# EAGLE design SafetySwitchBoard (EAGLE 9.5.2)
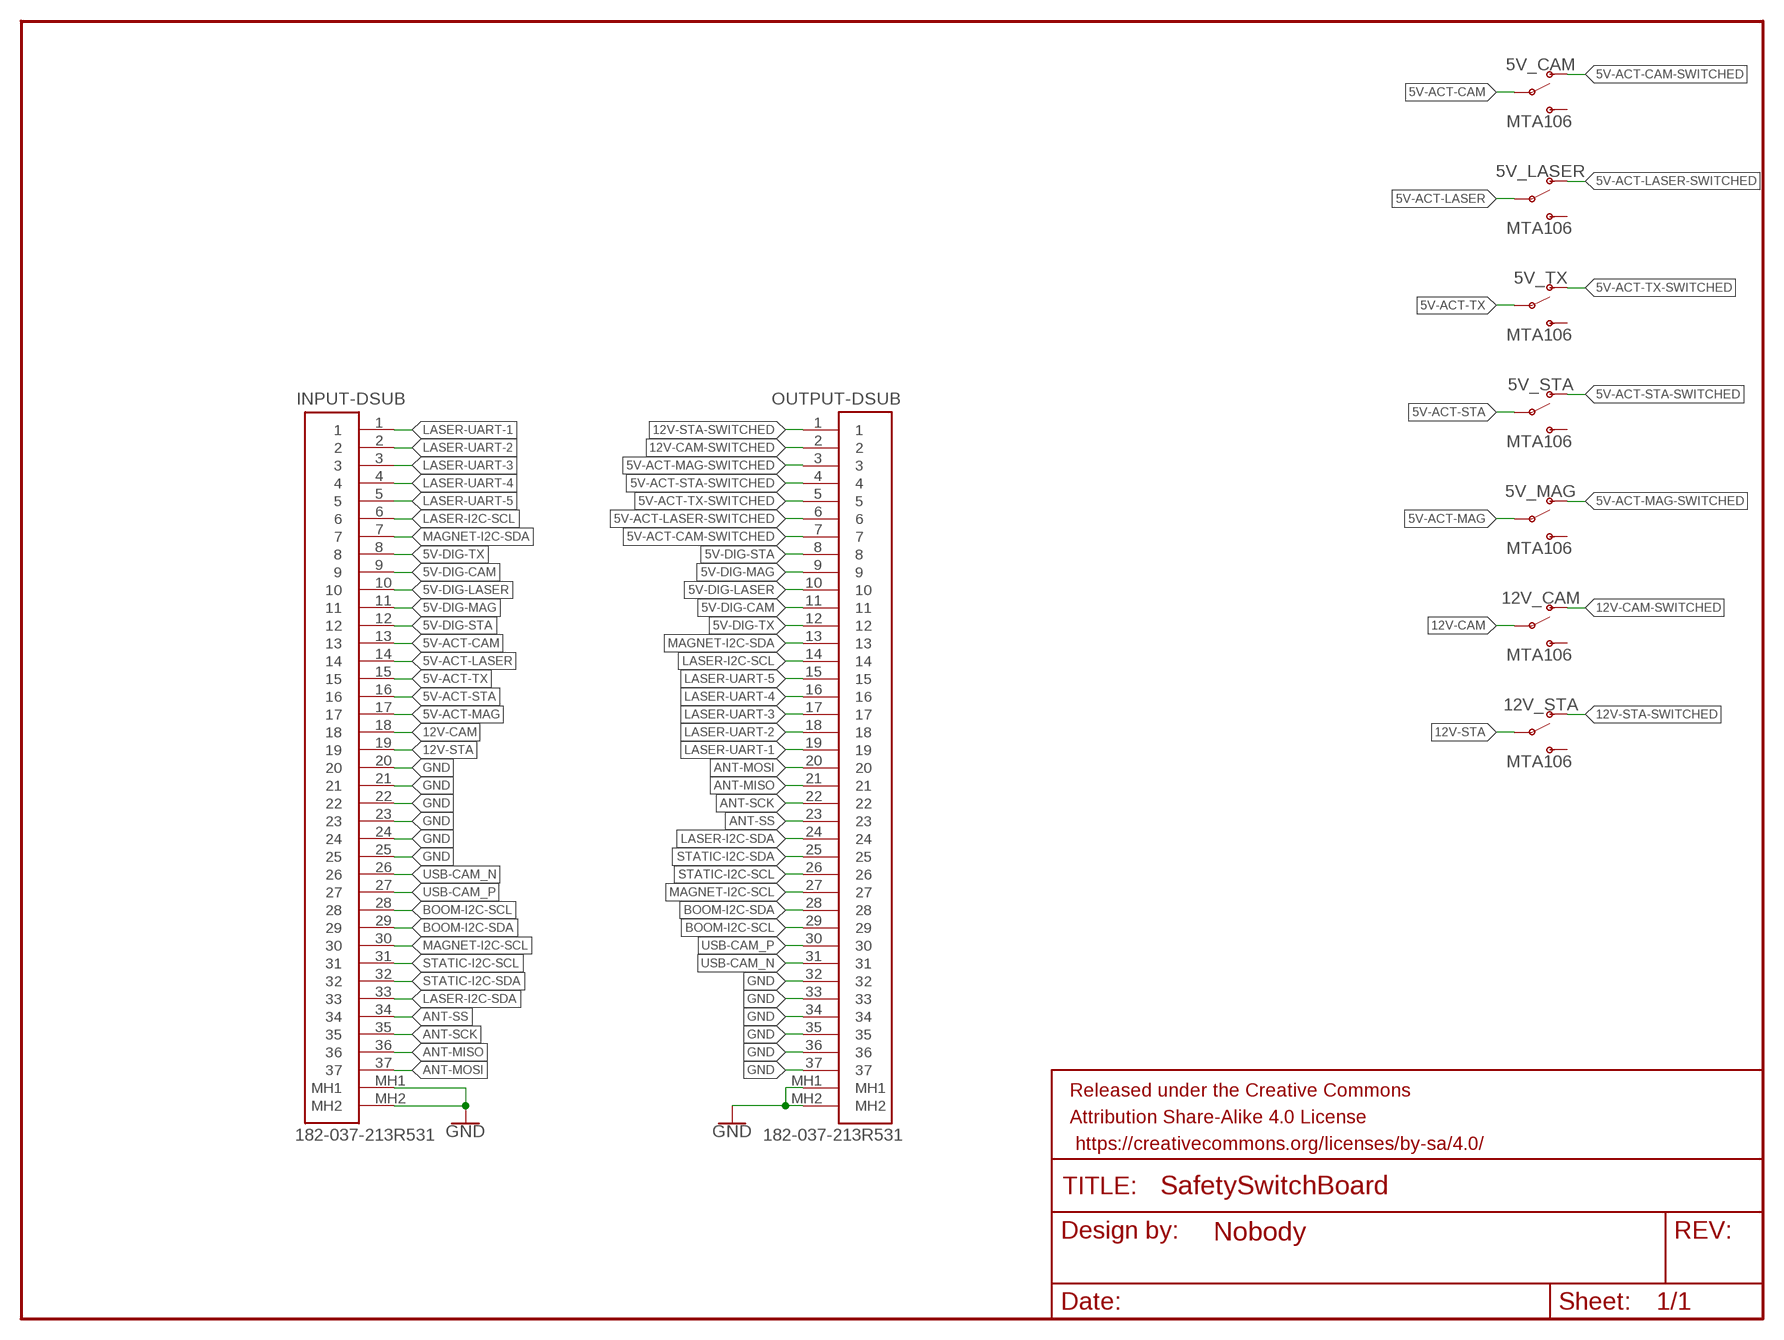
[diagram p0: schematic, sheet 1]

## Parts
5V_CAM  MTA106  [MTA106]
5V_LASER  MTA106  [MTA106]
5V_MAG  MTA106  [MTA106]
5V_STA  MTA106  [MTA106]
5V_TX  MTA106  [MTA106]
12V_CAM  MTA106  [MTA106]
12V_STA  MTA106  [MTA106]
FRAME1  FRAME-LETTERNO_PACKAGE  [DUMMY]
INPUT-DSUB  182-037-213R531  [182-037-213R531]
OUTPUT-DSUB  182-037-213R531  [182-037-213R531]

## Nets
5V-ACT-CAM: 5V_CAM.P$1(P) INPUT-DSUB.13
5V-ACT-CAM-SWITCHED: 5V_CAM.P$2(O) OUTPUT-DSUB.7
5V-ACT-LASER: 5V_LASER.P$1(P) INPUT-DSUB.14
5V-ACT-LASER-SWITCHED: 5V_LASER.P$2(O) OUTPUT-DSUB.6
5V-ACT-MAG: 5V_MAG.P$1(P) INPUT-DSUB.17
5V-ACT-MAG-SWITCHED: 5V_MAG.P$2(O) OUTPUT-DSUB.3
5V-ACT-STA: 5V_STA.P$1(P) INPUT-DSUB.16
5V-ACT-STA-SWITCHED: 5V_STA.P$2(O) OUTPUT-DSUB.4
5V-ACT-TX: 5V_TX.P$1(P) INPUT-DSUB.15
5V-ACT-TX-SWITCHED: 5V_TX.P$2(O) OUTPUT-DSUB.5
5V-DIG-CAM: INPUT-DSUB.9 OUTPUT-DSUB.11
5V-DIG-LASER: INPUT-DSUB.10 OUTPUT-DSUB.10
5V-DIG-MAG: INPUT-DSUB.11 OUTPUT-DSUB.9
5V-DIG-STA: INPUT-DSUB.12 OUTPUT-DSUB.8
5V-DIG-TX: INPUT-DSUB.8 OUTPUT-DSUB.12
12V-CAM: 12V_CAM.P$1(P) INPUT-DSUB.18
12V-CAM-SWITCHED: 12V_CAM.P$2(O) OUTPUT-DSUB.2
12V-STA: 12V_STA.P$1(P) INPUT-DSUB.19
12V-STA-SWITCHED: 12V_STA.P$2(O) OUTPUT-DSUB.1
ANT-MISO: INPUT-DSUB.36 OUTPUT-DSUB.21
ANT-MOSI: INPUT-DSUB.37 OUTPUT-DSUB.20
ANT-SCK: INPUT-DSUB.35 OUTPUT-DSUB.22
ANT-SS: INPUT-DSUB.34 OUTPUT-DSUB.23
BOOM-I2C-SCL: INPUT-DSUB.28 OUTPUT-DSUB.29
BOOM-I2C-SDA: INPUT-DSUB.29 OUTPUT-DSUB.28
GND: INPUT-DSUB.20 INPUT-DSUB.21 INPUT-DSUB.22 INPUT-DSUB.23 INPUT-DSUB.24 INPUT-DSUB.25 INPUT-DSUB.MH1 INPUT-DSUB.MH2 OUTPUT-DSUB.32 OUTPUT-DSUB.33 OUTPUT-DSUB.34 OUTPUT-DSUB.35 OUTPUT-DSUB.36 OUTPUT-DSUB.37 OUTPUT-DSUB.MH1 OUTPUT-DSUB.MH2
LASER-I2C-SCL: INPUT-DSUB.6 OUTPUT-DSUB.14
LASER-I2C-SDA: INPUT-DSUB.33 OUTPUT-DSUB.24
LASER-UART-1: INPUT-DSUB.1 OUTPUT-DSUB.19
LASER-UART-2: INPUT-DSUB.2 OUTPUT-DSUB.18
LASER-UART-3: INPUT-DSUB.3 OUTPUT-DSUB.17
LASER-UART-4: INPUT-DSUB.4 OUTPUT-DSUB.16
LASER-UART-5: INPUT-DSUB.5 OUTPUT-DSUB.15
MAGNET-I2C-SCL: INPUT-DSUB.30 OUTPUT-DSUB.27
MAGNET-I2C-SDA: INPUT-DSUB.7 OUTPUT-DSUB.13
STATIC-I2C-SCL: INPUT-DSUB.31 OUTPUT-DSUB.26
STATIC-I2C-SDA: INPUT-DSUB.32 OUTPUT-DSUB.25
USB-CAM_N [USB-DIFF]: INPUT-DSUB.26 OUTPUT-DSUB.31
USB-CAM_P [USB-DIFF]: INPUT-DSUB.27 OUTPUT-DSUB.30
Unconnected: 5V_CAM.P$3(S) 5V_LASER.P$3(S) 5V_MAG.P$3(S) 5V_STA.P$3(S) 5V_TX.P$3(S) 12V_CAM.P$3(S) 12V_STA.P$3(S)

## Library data of the parts
5V_CAM 5V_LASER 5V_MAG 5V_STA 5V_TX 12V_CAM 12V_STA = PowerManagementParts:MTA106
FRAME1 = SparkFun-Aesthetics:FRAME-LETTER: Schematic Frame - Letter Standard 8.5x11 US Letter frame; DESIGNER: Nobody; VERSION: v01
INPUT-DSUB OUTPUT-DSUB = D-Sub Connectors:182-037-213R531: CONN D-SUB RCPT 37POS R/A SOLDER Manufacturer's datasheet <https://media.digikey.com/pdf/Data%20Sheets/Norcomp%20PDFs/182-YYY-213RYY1.pdf>; CREATED_BY: PCBLayout.com; DIGI_KEY_PART_NUMBER: 182-37FE-ND; MANUFACTURER: NorComp Inc.; MPN: 182-037-213R531

## Net classes
1 USB-DIFF: width 0.406 mm, clearance 0.254 mm

## Board
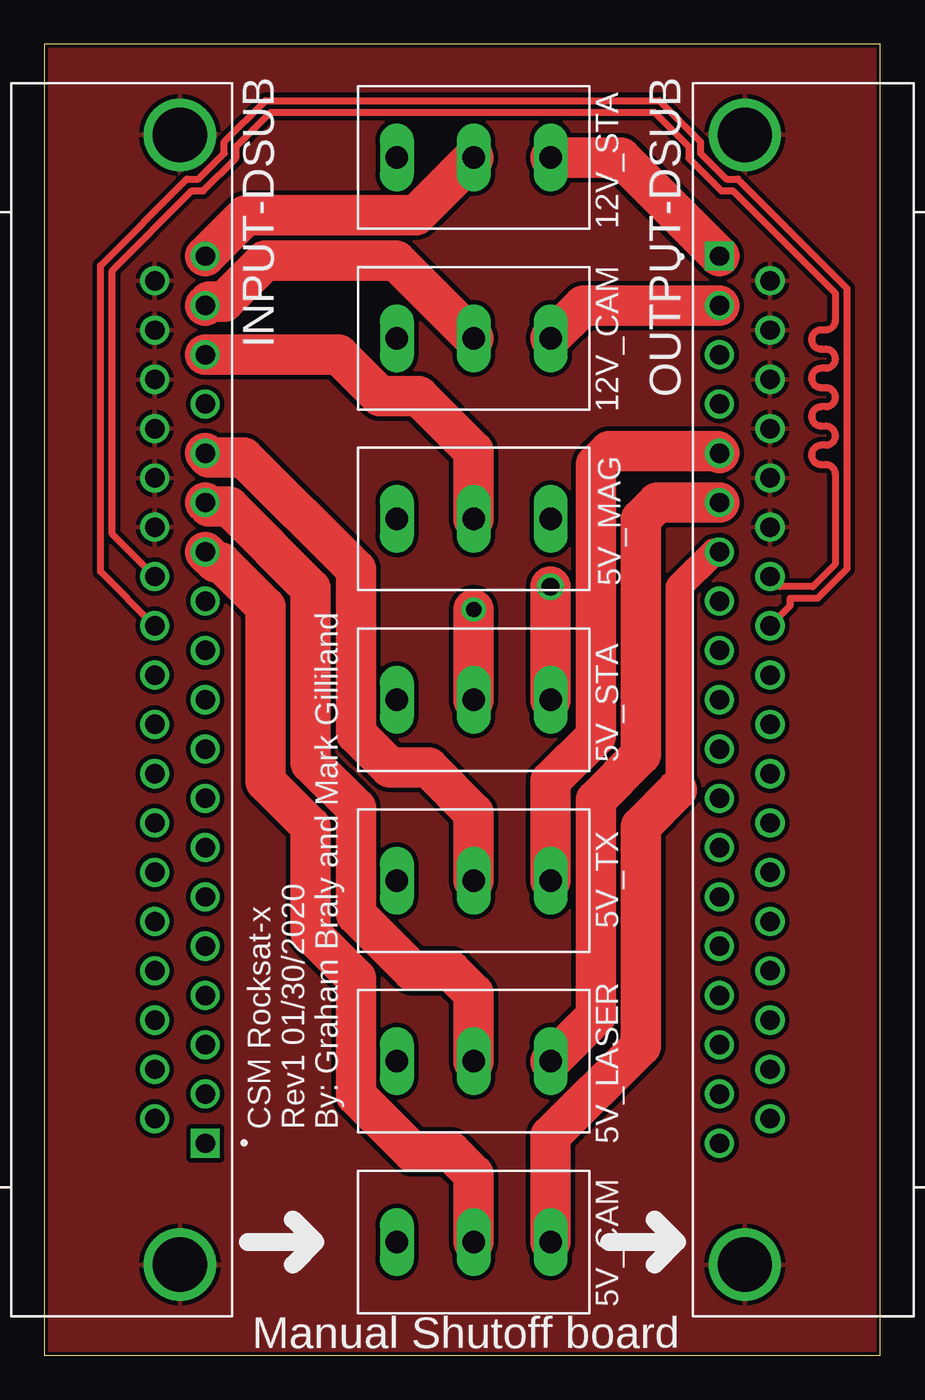
[diagram p1: board, top side]
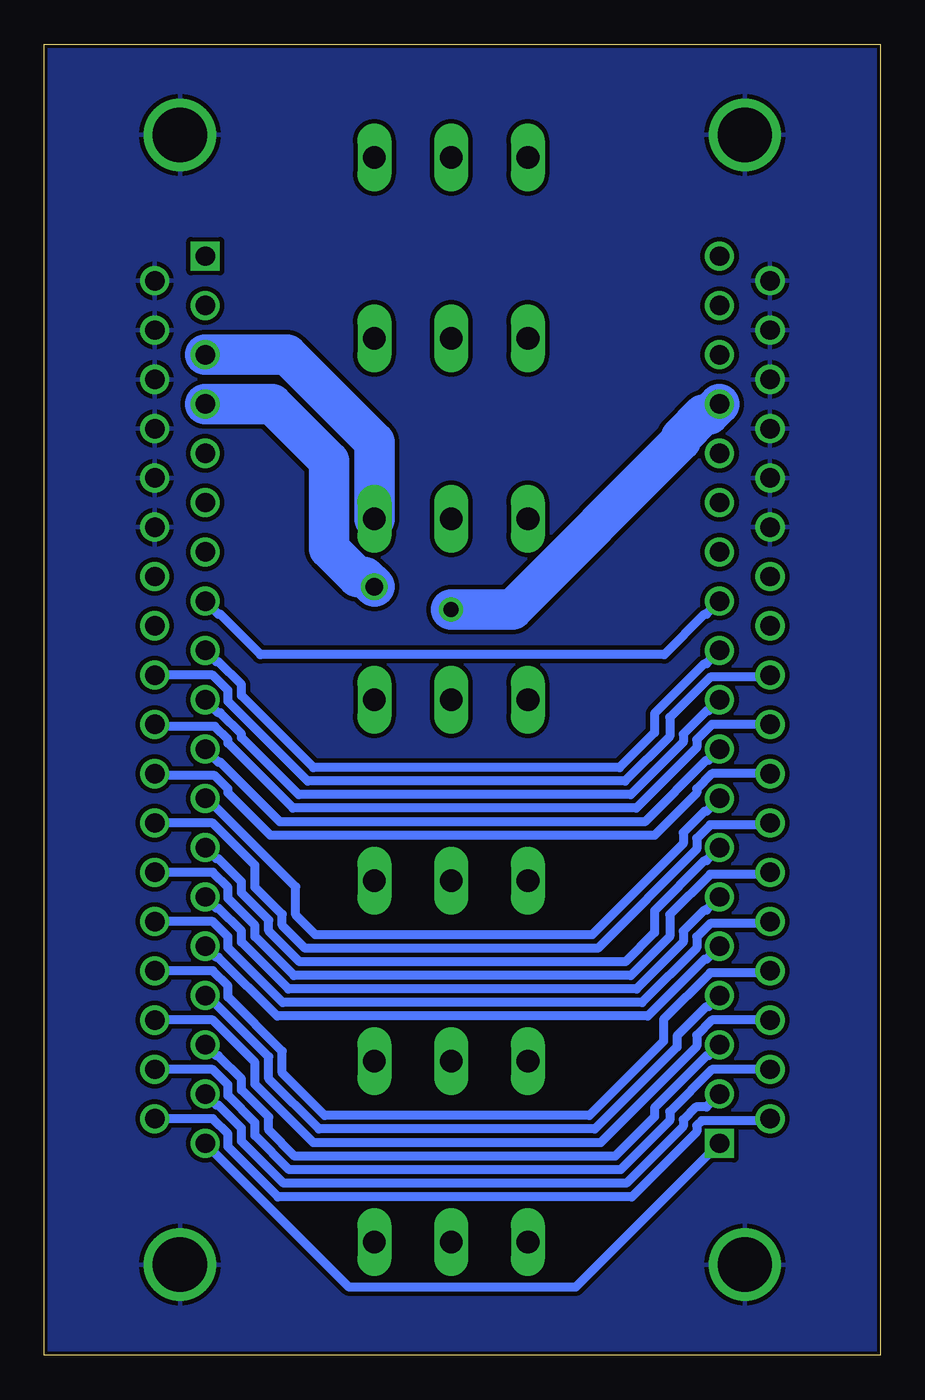
[diagram p2: board, bottom side, seen from below]

Size 46.99 x 73.66 mm. Coordinates in mm from the lower left corner, seen from the top.
Outline: 0,0 46.99,0 46.99,73.66 0,73.66 0,0
Copper layers (1*16): Top 0.035mm / dielectric 1.5mm / Bottom 0.035mm
Design rules "SparkFun-2-layer-STANDARD_13milDrill": minimum track width 10mil, minimum drill 13mil, track to track 10mil, track to pad 8mil, pad to pad 8mil, via to via 10mil, smd to smd 8mil, copper to edge 8mil, drill to drill 8mil, minimum pad ring 10mil, minimum via ring 10mil, stop-mask expansion 4mil, vias tented up to drill 25mil, thermal gap 10mil

### Footprints (pad centres in the part's own frame; a part is rotated, then mirrored left to right if it is on the bottom)
MTA106 = drill 1.27 long: P$1 0,0; P$2 0,4.318; P$3 0,-4.318
182-037-213R531 = drill 1.09 square: 1 24.93,1.42 | drill 1.09: 2 22.16,1.42; 3 19.39,1.42; 4 16.62,1.42; 5 13.85,1.42; 6 11.08,1.42; 7 8.31,1.42; 8 5.54,1.42; 9 2.77,1.42; 10 0,1.42; 11 -2.77,1.42; 12 -5.54,1.42; 13 -8.31,1.42; 14 -11.08,1.42; 15 -13.85,1.42; 16 -16.62,1.42; 17 -19.39,1.42; 18 -22.16,1.42; 19 -24.93,1.42; 20 -23.545,-1.42; 21 -20.775,-1.42; 22 -18.005,-1.42; 23 -15.235,-1.42; 24 -12.465,-1.42; 25 -9.695,-1.42; 26 -6.925,-1.42; 27 -4.155,-1.42; 28 -1.385,-1.42; 29 1.385,-1.42; 30 4.155,-1.42; 31 6.925,-1.42; 32 9.695,-1.42; 33 12.465,-1.42; 34 15.235,-1.42; 35 18.005,-1.42; 36 20.775,-1.42; 37 23.545,-1.42 | drill 3.05: MH1 -31.75,0; MH2 31.75,0

### Placement (x,y rotation side)
5V_CAM  24.13,6.35 270 top
5V_LASER  24.13,16.51 270 top
5V_MAG  24.13,46.99 270 top
5V_STA  24.13,36.83 270 top
5V_TX  24.13,26.67 270 top
12V_CAM  24.13,57.15 270 top
12V_STA  24.13,67.31 270 top
FRAME1  0,0 0 top
INPUT-DSUB  7.62,36.83 270 top
OUTPUT-DSUB  39.37,36.83 90 top

### Tracks (layer width: path | path; a pad name or v marks a point on that pad's centre or on a via)
5V-ACT-CAM
  Top 2.286: INPUT-DSUB.13 9.65,44.53 9.94,44.53 12.43,42.04 12.43,32.23 14.97,29.7 14.97,23.71 17.51,21.17 17.51,14.61 20.69,11.43 22.86,11.43 24.13,10.16 5V_CAM.P$1
5V-ACT-CAM-SWITCHED
  Top 1.524: 35.56,31.75 35.69,31.88 35.69,43.18 37.65,45.14 OUTPUT-DSUB.7
  Top 2.286: 35.56,31.75 33.53,29.72 33.53,17.39 28.45,12.31 5V_CAM.P$2
5V-ACT-LASER
  Top 2.286: INPUT-DSUB.14 9.27,47.68 10.38,47.68 14.97,43.09 14.97,33.29 17.51,30.75 17.51,24.77 20.69,21.59 22.86,21.59 24.13,20.32 5V_LASER.P$1
5V-ACT-LASER-SWITCHED
  Top 2.286: 5V_LASER.P$2 30.99,19.05 30.99,31.21 33.53,33.75 33.53,46.99 34.45,47.91 OUTPUT-DSUB.6
5V-ACT-MAG
  Top 2.286: 5V_MAG.P$1 24.13,50.8 21.03,53.9 18.86,53.9 16.54,56.22 INPUT-DSUB.17
5V-ACT-MAG-SWITCHED
  Bottom 2.286: 5V_MAG.P$2 28.45,51.31 33.36,56.22 OUTPUT-DSUB.3
5V-ACT-STA  (via drill 0.85)
  Top 2.286: v24.13,41.91 5V_STA.P$1
  Bottom 2.286: INPUT-DSUB.16 9.65,52.84 9.94,52.84 11.2,51.58 11.2,51.4 20.69,41.91 v24.13,41.91
5V-ACT-STA-SWITCHED  (via drill 1)
  Top 2.286: 5V_STA.P$2 v28.45,43.18
  Bottom 2.286: v28.45,43.18 29.01,43.74 29.4,43.74 30.99,45.33 30.99,50.26 34.18,53.45 OUTPUT-DSUB.4
5V-ACT-TX
  Top 2.286: INPUT-DSUB.15 9.27,50.45 11.2,50.45 17.51,44.14 17.51,34.92 19.42,33.02 21.59,33.02 24.13,30.48 5V_TX.P$1
5V-ACT-TX-SWITCHED
  Top 2.286: 5V_TX.P$2 28.45,32.26 30.99,34.8 30.99,50.04 31.75,50.8 37.83,50.8 OUTPUT-DSUB.5
5V-DIG-CAM
  Bottom 0.508: INPUT-DSUB.9 9.66,33.44 9.77,33.44 13.24,29.97 33.75,29.97 37.11,33.33 37.22,33.33 OUTPUT-DSUB.11
5V-DIG-LASER
  Bottom 0.508: INPUT-DSUB.10 9.66,36.21 9.77,36.21 11.08,34.9 11.08,34.45 14.03,31.5 32.7,31.5 35.91,34.7 35.91,34.9 37.11,36.1 37.22,36.1 OUTPUT-DSUB.10
5V-DIG-MAG
  Bottom 0.508: INPUT-DSUB.11 9.77,38.87 9.88,38.87 12.7,36.05 12.7,34.98 14.66,33.02 31.87,33.02 35.91,37.06 35.91,37.67 37.22,38.98 37.33,38.98 OUTPUT-DSUB.9
5V-DIG-STA
  Bottom 0.508: INPUT-DSUB.12 9.77,41.64 9.88,41.64 12.15,39.37 34.84,39.37 37.11,41.64 37.22,41.64 OUTPUT-DSUB.8
5V-DIG-TX
  Bottom 0.508: INPUT-DSUB.8 9.77,30.56 9.88,30.56 11.08,29.36 11.08,28.75 16.2,23.62 31.75,23.62 32.87,24.74 32.87,26.32 37.84,31.29 OUTPUT-DSUB.12
12V-CAM
  Top 2.286: INPUT-DSUB.18 9.27,59.22 10.09,59.22 12.39,61.52 19.76,61.52 12V_CAM.P$1
12V-CAM-SWITCHED
  Top 2.286: 12V_CAM.P$2 30.29,58.99 OUTPUT-DSUB.2
12V-STA
  Top 2.286: INPUT-DSUB.19 11.34,64.06 20.88,64.06 12V_STA.P$1
12V-STA-SWITCHED
  Top 2.286: 12V_STA.P$2 32.4,67.31 OUTPUT-DSUB.1
ANT-MISO
  Bottom 0.508: INPUT-DSUB.36 9.46,16.05 11.84,13.67 11.84,13.18 14.6,10.41 33.23,10.41 35.15,12.33 35.15,13.06 36.67,14.58 36.67,15.2 37.53,16.05 OUTPUT-DSUB.21
ANT-MOSI
  Bottom 0.508: INPUT-DSUB.37 6.31,13.18 10.05,13.18 10.31,12.91 10.31,12.54 13.97,8.89 33.86,8.89 36.67,11.7 36.67,12.43 37.53,13.29 OUTPUT-DSUB.20
ANT-SCK
  Bottom 0.508: INPUT-DSUB.35 9.46,18.82 10.31,17.97 10.31,17.35 15.73,11.94 31.88,11.94 35.15,15.21 35.15,16.44 37.53,18.82 OUTPUT-DSUB.22
ANT-SS
  Bottom 0.508: INPUT-DSUB.34 6.31,21.48 9.57,21.48 12.19,18.86 12.19,17.63 16.36,13.46 31.24,13.46 33.63,15.85 33.63,17.07 36.67,20.12 36.67,20.74 37.53,21.59 OUTPUT-DSUB.23
BOOM-I2C-SCL
  Bottom 0.508: INPUT-DSUB.28 6.31,38.1 9.57,38.1 11.84,35.83 11.84,34.77 14.35,32.26 32.19,32.26 36.67,36.74 36.67,37.36 37.53,38.22 OUTPUT-DSUB.29
BOOM-I2C-SDA
  Bottom 0.508: INPUT-DSUB.29 9.46,35.45 10.31,34.59 10.31,34.13 13.72,30.73 33.02,30.73 36.67,34.39 36.67,34.59 37.42,35.34 40.68,35.34 OUTPUT-DSUB.28
GND
  pour Bottom: 0,0 46.99,0 46.99,73.66 0,73.66
  pour Top: 0,0 46.99,0 46.99,73.66 0,73.66
LASER-I2C-SCL
  Bottom 0.508: INPUT-DSUB.6 9.77,25.02 9.88,25.02 11.08,23.82 11.08,23.21 13.71,20.57 33.28,20.57 35.91,23.21 35.91,23.82 37.22,25.13 37.33,25.13 OUTPUT-DSUB.14
LASER-I2C-SDA
  Bottom 0.508: INPUT-DSUB.33 6.31,24.25 9.57,24.25 10.31,23.51 10.31,22.89 13.4,19.81 33.59,19.81 36.67,22.89 36.67,23.51 37.53,24.36 OUTPUT-DSUB.24
LASER-UART-1
  Bottom 0.508: INPUT-DSUB.1 17.13,3.81 29.86,3.81 OUTPUT-DSUB.19
LASER-UART-2
  Bottom 0.508: INPUT-DSUB.2 9.77,13.94 10.36,13.94 11.08,13.22 11.08,12.86 14.29,9.65 33.55,9.65 35.91,12.02 35.91,12.74 37.22,14.05 37.33,14.05 OUTPUT-DSUB.18
LASER-UART-3
  Bottom 0.508: INPUT-DSUB.3 9.66,16.82 9.77,16.82 12.7,13.89 12.7,13.39 14.92,11.18 32.91,11.18 34.39,12.65 34.39,13.38 35.91,14.9 35.91,15.51 37.22,16.82 37.33,16.82 OUTPUT-DSUB.17
LASER-UART-4
  Bottom 0.508: INPUT-DSUB.4 9.66,19.59 9.77,19.59 11.43,17.93 11.43,17.32 16.05,12.7 31.56,12.7 34.39,15.53 34.39,16.76 37.84,20.21 OUTPUT-DSUB.16
LASER-UART-5
  Bottom 0.508: INPUT-DSUB.5 9.77,22.25 9.88,22.25 13.08,19.05 33.91,19.05 37.22,22.36 37.33,22.36 OUTPUT-DSUB.15
MAGNET-I2C-SCL
  Bottom 0.508: INPUT-DSUB.30 9.46,32.67 10.31,31.82 10.31,31.59 12.7,29.21 34.29,29.21 36.67,31.59 36.67,31.82 37.42,32.56 40.68,32.56 OUTPUT-DSUB.27
MAGNET-I2C-SDA
  Bottom 0.508: INPUT-DSUB.7 9.77,27.79 9.88,27.79 12.7,24.97 12.7,23.74 14.34,22.1 32.65,22.1 34.39,23.84 34.39,24.45 35.91,25.98 35.91,26.59 37.22,27.9 37.33,27.9 OUTPUT-DSUB.13
STATIC-I2C-SCL
  Bottom 0.508: INPUT-DSUB.31 6.31,29.8 9.57,29.8 10.31,29.05 10.31,28.43 15.89,22.86 32.33,22.86 33.63,24.16 33.63,24.77 35.15,26.3 35.15,27.52 37.53,29.91 OUTPUT-DSUB.26
STATIC-I2C-SDA
  Bottom 0.508: INPUT-DSUB.32 6.31,27.02 9.57,27.02 11.84,24.75 11.84,23.52 14.03,21.34 32.96,21.34 35.15,23.52 35.15,24.14 36.67,25.66 36.67,26.28 37.53,27.14 OUTPUT-DSUB.25
USB-CAM_N
  Top 0.406: INPUT-DSUB.26 3.81,46.15 3.81,60.96 8.28,65.43 8.93,65.43 10.77,67.28 10.77,67.92 12.7,69.85 34.29,69.85 36.22,67.92 36.22,67.28 38.06,65.43 38.71,65.43 44.45,59.69 44.45,58.14 arc-90 43.93,57.62 43.65,57.62 arc90 43.13,57.1 43.13,57.06 arc90 43.65,56.54 43.93,56.54 arc-90 44.45,56.02 44.45,55.98 arc-90 43.93,55.46 43.65,55.46 arc90 43.13,54.94 43.13,54.9 arc90 43.65,54.38 43.93,54.38 arc-90 44.45,53.85 44.45,53.81 arc-90 43.93,53.29 43.65,53.29 arc90 43.13,52.77 43.13,52.73 arc90 43.65,52.21 43.93,52.21 arc-90 44.45,51.69 44.45,51.65 arc-90 43.93,51.13 43.65,51.13 arc90 43.13,50.61 43.13,50.57 arc90 43.65,50.05 43.93,50.05 arc-90 44.45,49.53 44.45,44.45 43.18,43.18 41.37,43.18 OUTPUT-DSUB.31
USB-CAM_P
  Top 0.406: INPUT-DSUB.27 3.15,44.03 3.15,61.23 8.01,66.09 8.65,66.09 10.11,67.55 10.11,68.19 12.43,70.51 34.56,70.51 36.88,68.19 36.88,67.55 38.34,66.09 38.98,66.09 45.11,59.96 45.11,44.18 43.45,42.52 41.91,42.52 41.91,42.1 OUTPUT-DSUB.30

### Text on the board
tPlace: CSM Rocksat-x / Rev1 01/30/2020 / By: Graham Braly and Mark Gilliland | Manual Shutoff board